# Altium schematic sheet project_info.SchDoc
size A4; SheetNumber: 8; SheetTotal: 8
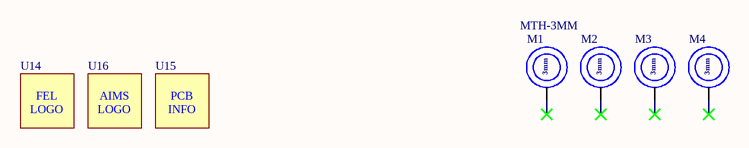
[diagram p0: project_info.SchDoc]

## Parts
M1  MTH-3MM  [MountingHole_3.0mm_NPTH]
M2  MTH-3MM  [MountingHole_3.0mm_NPTH]  (value not drawn)
M3  MTH-3MM  [MountingHole_3.0mm_NPTH]  (value not drawn)
M4  MTH-3MM  [MountingHole_3.0mm_NPTH]  (value not drawn)
U14  SYM+FEL_LOGO  [FEL_LOGO_MED]  (value not drawn)
U15  SYM+PCB_INFO  [PCB_INFO]  (value not drawn)
U16  SYM+AIMS_LOGO  [AIMS_LOGO]  (value not drawn)

## Nets

Not connected (* = marked no-connect by the designer): M1 1*; M2 1*; M3 1*; M4 1*

## Notes on the sheet
- Název výkresu /drawing title/:
- Název souboru /sheet name/:
- Varianta /variant/:
- Organizace /organisation/:
- ČVUT FEL
- Kreslil /drawn by/:
- Datum /date/:
- Podpis /signature/:
- List /sheet/:
- Verze /version/:
- /
- (in symbol EMECH-MTH-3MM) 3mm
- (in symbol SYM+AIMS_LOGO) AIMS / LOGO
- (in symbol SYM+FEL_LOGO) FEL / LOGO
- (in symbol SYM+PCB_INFO) PCB / INFO

## Library data of the parts
M1-M4 = EMECH-MTH-3MM